# Altium schematic sheet Liquid Tremolo.SchDoc
size A3; SheetNumber: 1; SheetTotal: 1
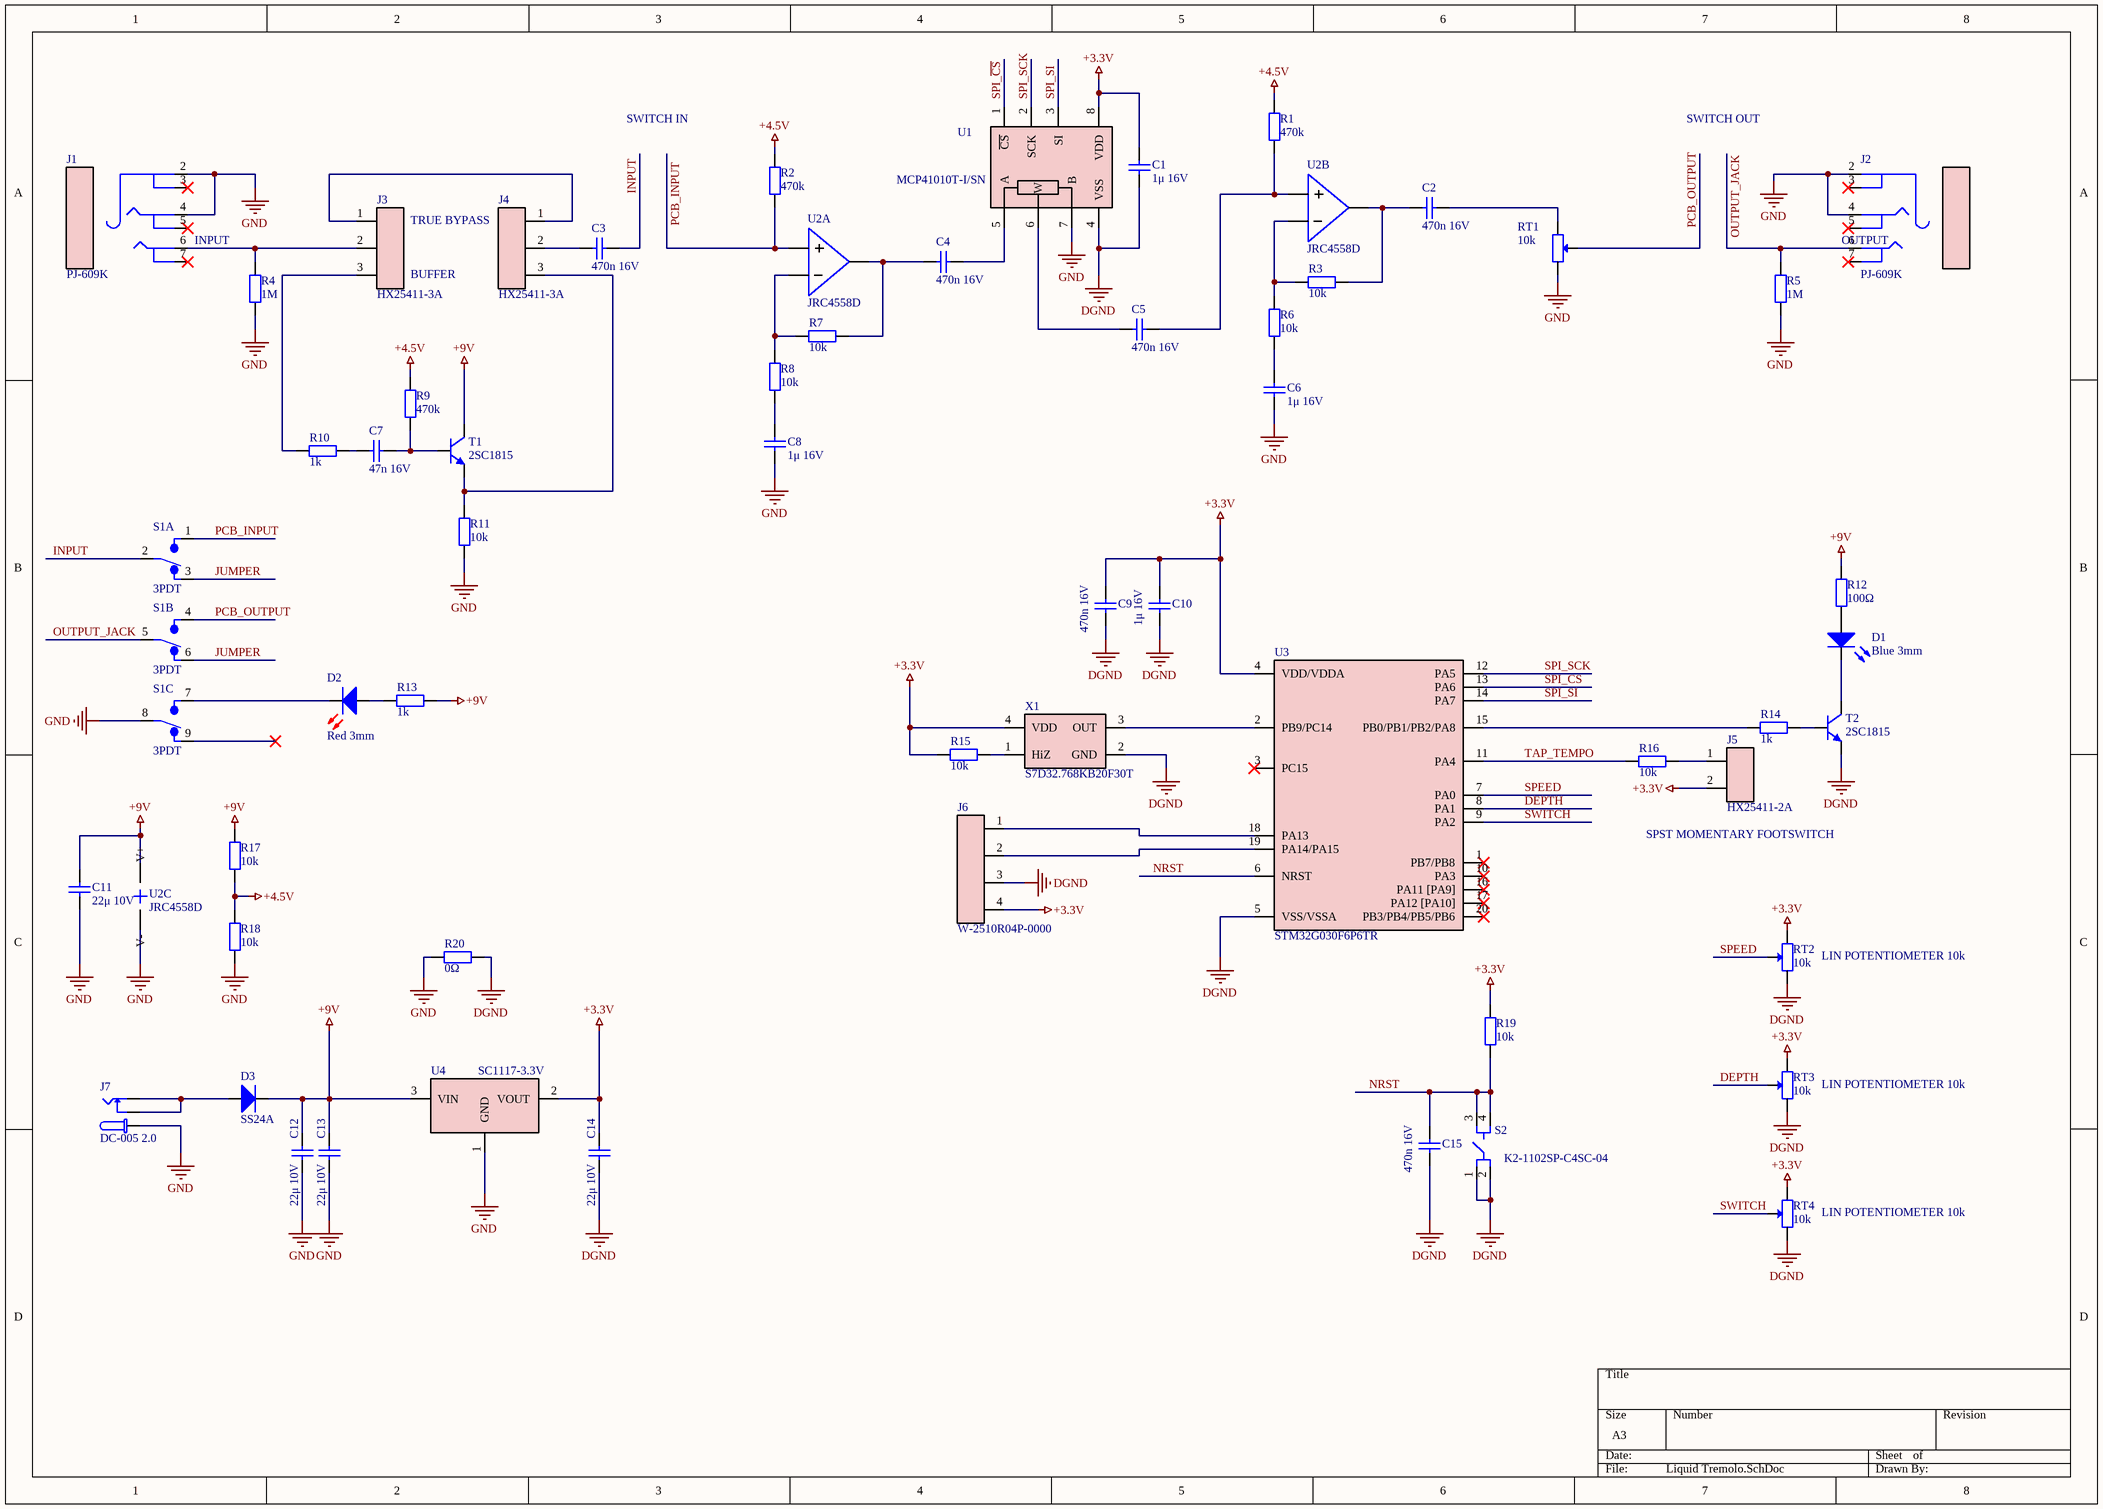
[diagram p0: Liquid Tremolo.SchDoc]

## Parts
C1  1μ 16V  [Capacitor 0603]
C2  470n 16V  [Capacitor 0603]
C3  470n 16V  [Capacitor 0603]
C4  470n 16V  [Capacitor 0603]
C5  470n 16V  [Capacitor 0603]
C6  1μ 16V  [Capacitor 0603]
C7  47n 16V  [Capacitor 0603]
C8  1μ 16V  [Capacitor 0603]
C9  470n 16V  [Capacitor 0603]
C10  1μ 16V  [Capacitor 0603]
C11  22μ 10V  [Capacitor 0603]
C12  22μ 10V  [Capacitor 0603]
C13  22μ 10V  [Capacitor 0603]
C14  22μ 10V  [Capacitor 0603]
C15  470n 16V  [Capacitor 0603]
D1  Blue 3mm  [LED 3MM BLUE]
D2  Red 3mm  [LED 3MM BLUE]
D3  SS24A  [SS24A]
J1  PJ-609K  [HOOYA PJ-609K]
J2  PJ-609K  [HOOYA PJ-609K]
J3  HX25411-3A  [HX25411-3A]
J4  HX25411-3A  [HX25411-3A]
J5  HX25411-2A  [HX25411-2A]
J6  W-2510R04P-0000  [W-2510R04P-0000]
J7  DC-005 2.0  [DC-005 2.0]
R1  470k  [Resistor 0603]
R2  470k  [Resistor 0603]
R3  10k  [Resistor 0603]
R4  1M  [Resistor 0603]
R5  1M  [Resistor 0603]
R6  10k  [Resistor 0603]
R7  10k  [Resistor 0603]
R8  10k  [Resistor 0603]
R9  470k  [Resistor 0603]
R10  1k  [Resistor 0603]
R11  10k  [Resistor 0603]
R12  100Ω  [Resistor 0603]
R13  1k  [Resistor 0603]
R14  1k  [Resistor 0603]
R15  10k  [Resistor 0603]
R16  10k  [Resistor 0603]
R17  10k  [Resistor 0603]
R18  10k  [Resistor 0603]
R19  10k  [Resistor 0603]
R20  0Ω  [Resistor 0603]
RT1  10k  [RK09D1130C2P]
RT2  10k  [RK09D1130C2P]
RT3  10k  [RK09D1130C2P]
RT4  10k  [RK09D1130C2P]
S1  3PDT  [3PDT]  (parts A,B,C of 3)
S2  K2-1102SP-C4SC-04  [K2-1102SP-C4SC-04]
T1  2SC1815  [2SC1815]
T2  2SC1815  [2SC1815]
U1  MCP41010T-I/SN  [MCP41010]
U2  JRC4558D  [JRC4558]  (parts A,B,C of 3)
U3  STM32G030F6P6TR  [STM32G030F6P6TR]
U4  SC1117-3.3V  [SC1117-3.3V]
X1  S7D32.768KB20F30T  [S7D32.768KB20F30T]

## Nets
+3.3V: C1.1 C9.2 C10.2 C14.2 J5.2 J6.4 R15.1 R19.2 RT2.1 RT3.1 RT4.1 U1.8(VDD) U3.4(VDD/VDDA) U4.2(VOUT) X1.4(VDD)
+4.5V: R1.2 R2.2 R9.2 R17.1 R18.2
+9V: C11.2 C12.2 C13.2 D3.2 R12.2 R13.2 R17.2 T1.3(C) U2.8(V+) U4.3(VIN)
DGND: C1.2 C9.1 C10.1 C14.1 C15.1 J6.3 R20.2 RT2.3 RT3.3 RT4.3 S2.1 S2.2 T2.2(E) U1.4(VSS) U3.5(VSS/VSSA) X1.2(GND)
GND: C6.1 C8.1 C11.1 C12.1 C13.1 J1.2 J1.4 J2.2 J2.4 J7.4 R4.1 R5.1 R11.1 R18.1 R20.1 RT1.3 S1.8 U1.7(B) U2.4(V-) U4.1(GND)
DEPTH: RT3.2 U3.8(PA1)
INPUT: C3.2 S1.2
JUMPER: S1.3 S1.6
NRST: C15.2 R19.1 S2.3 S2.4 U3.6(NRST)
OUTPUT_JACK: J2.6 R5.2 S1.5
PCB_INPUT: R2.1 S1.1 U2.3(IN+)
PCB_OUTPUT: RT1.2 S1.4
SPEED: RT2.2 U3.7(PA0)
SPI_~{CS}: U1.1(~{CS}) U3.13(PA6)
SPI_SCK: U1.2(SCK) U3.12(PA5)
SPI_SI: U1.3(SI) U3.14(PA7)
SWITCH: RT4.2 U3.9(PA2)
TAP_TEMPO: R16.1 U3.11(PA4)
NetC2_1: C2.1 R3.1 U2.7(OUT)
NetC2_2: C2.2 RT1.1
NetC3_1: C3.1 J4.2
NetC4_1: C4.1 R7.1 U2.1(OUT)
NetC4_2: C4.2 U1.5(A)
NetC5_1: C5.1 U1.6(W)
NetC5_2: C5.2 R1.1 U2.5(IN+)
NetC6_2: C6.2 R6.1
NetC7_1: C7.1 R10.2
NetC7_2: C7.2 R9.1 T1.1(B)
NetC8_2: C8.2 R8.1
NetD1_1: D1.1 T2.3(C)
NetD1_2: D1.2 R12.1
NetD2_1: D2.1 S1.7
NetD2_2: D2.2 R13.1
NetD3_1: D3.1 J7.2 J7.3
NetJ1_6: J1.6 J3.2 R4.2
NetJ3_1: J3.1 J4.1
NetJ3_3: J3.3 R10.1
NetJ4_3: J4.3 R11.2 T1.2(E)
NetJ5_1: J5.1 R16.2
NetJ6_1: J6.1 U3.18(PA13)
NetJ6_2: J6.2 U3.19(PA14/PA15)
NetR3_2: R3.2 R6.2 U2.6(IN-)
NetR7_2: R7.2 R8.2 U2.2(IN-)
NetR14_1: R14.1 U3.15(PB0/PB1/PB2/PA8)
NetR14_2: R14.2 T2.1(B)
NetR15_2: R15.2 X1.1(HiZ)
NetU3_2: U3.2(PB9/PC14) X1.3(OUT)

Not connected (* = marked no-connect by the designer): J1 3* 5* 7*; J2 3* 5* 7*; S1 9*; U3 1(PB7/PB8)* 3(PC15)* 10(PA3)* 16(PA11_[PA9])* 17(PA12_[PA10])* 20(PB3/PB4/PB5/PB6)*

## Notes on the sheet
- SWITCH IN
- SWITCH OUT
- INPUT
- TRUE BYPASS
- OUTPUT
- (near J3) BUFFER
- (near J5) SPST MOMENTARY FOOTSWITCH
- (near RT2) LIN POTENTIOMETER 10k
- (near RT3) LIN POTENTIOMETER 10k
- (near RT4) LIN POTENTIOMETER 10k

## Library data of the parts
C1 C6 C8 C10 = Capacitor 1μF 0603 ±10% 16V: X7R ±10% 1uF 16V 0603 Multilayer Ceramic Capacitors MLCC - SMD/SMT ROHS; Mfr. Part #: CC0603KRX7R7BB105; Type: SMD; LCSC Part #: C106248; Package: 0603; ComponentLink1Description: Datasheet; ComponentLink1URL: https://datasheet.lcsc.com/lcsc/1811082135_YAGEO-CC0603KRX7R7BB473_C115058.pdf
C2-C5 C9 C15 = Capacitor 470nF 0603 ±10% 16V: X7R ±10% 470nF 16V 0603 Multilayer Ceramic Capacitors MLCC - SMD/SMT ROHS; Mfr. Part #: CC0603KRX7R7BB474; Type: SMD; LCSC Part #: C106851; Package: 0603; ComponentLink1Description: Datasheet; ComponentLink1URL: https://datasheet.lcsc.com/lcsc/1811082135_YAGEO-CC0603KRX7R7BB473_C115058.pdf
C7 = Capacitor 47nF 0603 ±10% 16V: X7R ±10% 47nF 16V 0603 Multilayer Ceramic Capacitors MLCC - SMD/SMT ROHS; Mfr. Part #: CC0603KRX7R7BB473; Type: SMD; LCSC Part #: C115058; Package: 0603; ComponentLink1Description: Datasheet; ComponentLink1URL: https://datasheet.lcsc.com/lcsc/1811082135_YAGEO-CC0603KRX7R7BB473_C115058.pdf
C11-C14 = Capacitor 22μF 0603 ±10% 16V: X5R ±20% 10V 22uF 0603 Multilayer Ceramic Capacitors MLCC - SMD/SMT ROHS; Mfr. Part #: 0603X226M100NT; Type: SMD; LCSC Part #: C60077; Package: 0603; ComponentLink1Description: Datasheet; ComponentLink1URL: https://datasheet.lcsc.com/lcsc/1811151152_FH-Guangdong-Fenghua-Advanced-Tech-0603X226M100NT_C60077.pdf
D1 = Diode LED Blue 3mm THT: Blue 460nm~470nm 2.7V~3.6V Through Hole Light Emitting Diodes (LED) ROHS; Mfr. Part #: TJ-L3FYTGCBMCGSFLC6B-A5; Type: THT; LCSC Part #: C330760; Package: Through Hole; ComponentLink1Description: Datasheet; ComponentLink1URL: https://datasheet.lcsc.com/lcsc/2006301911_TOGIALED-TJ-L3FYTGCBMCGSFLC6B-A5_C330760.pdf
D2 = Diode LED Red 3mm THT: Red 620nm~630nm 1.8V~2.6V Through Hole Light Emitting Diodes (LED) ROHS; Mfr. Part #: TJ-L4FYTGCRMFCSFLC2R-A5; Type: THT; LCSC Part #: C331039; Package: Through Hole; ComponentLink1Description: Datasheet; ComponentLink1URL: https://datasheet.lcsc.com/lcsc/2006301911_TOGIALED-TJ-L3FYTGCBMCGSFLC6B-A5_C330760.pdf
D3 = Diode 40V 2A 500mV SS24A: 40V 2A 500mV @ 2A SMA(DO-214AC) Schottky Barrier Diodes (SBD) ROHS; Type: SMD; Mfr. Part #: SS24A; LCSC Part #: C181203; Package: SMA(DO-214AC); ComponentLink1Description: Datasheet; ComponentLink1URL: https://datasheet.lcsc.com/lcsc/1811151533_Guangdong-Hottech-SS24A_C181203.pdf
J1 J2 = Mechanical Connector JACK 6.35mm PJ-609K: 6.35mm Plug-in headphone holder Horizontal 6 Female - Audio & Video Connectors ROHS; Mfr. Part #: PJ-609K; LCSC Part #: C309276; Package: -; ComponentLink1Description: Datasheet; ComponentLink1URL: https://datasheet.lcsc.com/lcsc/1912111437_HOOYA-PJ-609K_C309276.pdf; Type: THT
J3 J4 = Mechanical Connector 3P 2.54mm THT HX25411-3A: 3 Header CH 0.100"(2.54mm) Male Pin Through Hole Wire To Board / Wire To Wire Connector ROHS; Mfr. Part #: HX25411-3A; LCSC Part #: C190647; Package: Through Hole; ComponentLink1Description: Datasheet; ComponentLink1URL: https://datasheet.lcsc.com/lcsc/1811151531_HX-Zhejiang-Yueqing-Hongxing-Elec-HX25411-3A_C190647.pdf; Type: THT
J5 = Mechanical Connector 2P 2.54mm THT HX25411-2A: LCSC Part # C181912 / Package P=2.54mm / Manufacturer HX(Zhejiang Yueqing Hongxing Elec); Mfr. Part #: HX25411-2A; LCSC Part #: C181912; Package: P=2.54mm; ComponentLink1Description: Datasheet; ComponentLink1URL: https://datasheet.lcsc.com/lcsc/1810161736_HX-Zhejiang-Yueqing-Hongxing-Elec-HX25411-2A_C181912.pdf; Type: THT
J6 = Mechanical Connector 4P 2.54mm THT Right Angle W-2510R04P-0000: 4 Header MX2.54 0.100"(2.54mm) Male Pin Through Hole,P=2.54mm Wire To Board / Wire To Wire Connector ROHS; Mfr. Part #: W-2510R04P-0000; LCSC Part #: C169027; Package: Through Hole; ComponentLink1Description: Datasheet; ComponentLink1URL: https://datasheet.lcsc.com/lcsc/1810222331_Ckmtw-Shenzhen-Cankemeng-W-2510R04P-0000_C169027.pdf; Type: THT
J7 = Mechanical DC Jack DC-005 2.0: Through Hole AC/DC Power Plugs & Receptacles ROHS; Mfr. Part #: DC-005 2.0; LCSC Part #: C16214; Package: Through Hole; ComponentLink1Description: Datasheet; ComponentLink1URL: https://datasheet.lcsc.com/lcsc/1811051112_BOOMELE-Boom-Precision-Elec-DC-005-2-0_C16214.pdf; Type: THT
R1 R2 R9 = Resistor 470kΩ 0603 ±1% 0.1W: ±1% 470kΩ ±100ppm/℃ 0.1W 0603 Chip Resistor - Surface Mount ROHS; Mfr. Part #: 0603WAF4703T5E; LCSC Part #: C23178; Package: 0603; ComponentLink1Description: Datasheet; ComponentLink1URL: https://datasheet.lcsc.com/lcsc/1811021221_UNI-ROYAL-Uniroyal-Elec-0603WAF4703T5E_C23178.pdf; Type: SMD
R3 R6-R8 R11 R15-R19 = Resistor 10kΩ 0603 ±1% 0.1W: ±1% ±100ppm/℃ 10kΩ 0.1W 0603 Chip Resistor - Surface Mount ROHS; Mfr. Part #: 0603WAF1002T5E; LCSC Part #: C25804; Package: 0603; ComponentLink1Description: Datasheet; ComponentLink1URL: https://datasheet.lcsc.com/lcsc/1811021221_UNI-ROYAL-Uniroyal-Elec-0603WAF4703T5E_C23178.pdf; Type: SMD
R4 R5 = Resistor 1MΩ 0603 ±1% 0.1W: 1MΩ ±1% 0.1W 0603 Chip Resistor - Surface Mount ROHS; Mfr. Part #: RMC06031M1%N; LCSC Part #: C269705; Package: 0603; ComponentLink1Description: Datasheet; ComponentLink1URL: https://datasheet.lcsc.com/lcsc/1811101311_TyoHM-RMC06031M1-N_C269705.pdf; Type: SMD
R10 R13 R14 = Resistor 1kΩ 0603 ±1% 0.1W: ±1% ±100ppm/℃ 1kΩ 0.1W 0603 Chip Resistor - Surface Mount ROHS; Mfr. Part #: RC0603FR-071KL; LCSC Part #: C22548; Package: 0603; ComponentLink1Description: Datasheet; ComponentLink1URL: https://datasheet.lcsc.com/lcsc/1810182020_YAGEO-RC0603FR-071KL_C22548.pdf; Type: SMD
R12 = Resistor 100Ω 0603 ±1% 0.1W: ±1% ±200ppm/℃ 100Ω 0.1W 0603 Chip Resistor - Surface Mount ROHS; Mfr. Part #: 0603WAF1000T5E; LCSC Part #: C22775; Package: 0603; ComponentLink1Description: Datasheet; ComponentLink1URL: https://datasheet.lcsc.com/lcsc/1811021221_UNI-ROYAL-Uniroyal-Elec-0603WAF4703T5E_C23178.pdf; Type: SMD
R20 = Resistor 0Ω 0603 ±1% 0.1W: 75V -55℃~+155℃ ±1% Thick Film Resistors 100mW 0Ω 0603 Chip Resistor - Surface Mount ROHS; Mfr. Part #: RC0603FR-070RL; LCSC Part #: C100044; Package: 0603; ComponentLink1Description: Datasheet; ComponentLink1URL: https://datasheet.lcsc.com/lcsc/1810182020_YAGEO-RC0603FR-071KL_C22548.pdf; Type: SMD
RT1-RT4 = Potentiometer 10kΩ plugin ±20% RK09D1130C2P: ±20% 10kΩ Plugin Variable Resistors/Potentiometers ROHS; Mfr. Part #: RK09D1130C2P; LCSC Part #: C361173; Package: Plugin; ComponentLink1Description: Datasheet; ComponentLink1URL: https://datasheet.lcsc.com/lcsc/1912111437_ALPSALPINE-RK09D1130C2P_C361173.pdf; Type: THT
S1 = Mechanical 3PDT Footswitch: Top Actuated 50mA @ 12VDC Round Button SPST 6*6mm Tactile Switches ROHS; ComponentLink1Description: Datasheet; ComponentLink1URL: https://effectpedalkits.com/wp-content/uploads/2018/02/3pdt-latching-footswitch-dimensions.jpg
S2 = Mechanical Tactile Switch 6x6mm SMD: Top Actuated 50mA @ 12VDC Round Button SPST 6*6mm Tactile Switches ROHS; Mfr. Part #: K2-1102SP-C4SC-04; LCSC Part #: C127509; Package: 6*6mm; ComponentLink1Description: Datasheet; ComponentLink1URL: https://datasheet.lcsc.com/lcsc/1811082113_Korean-Hroparts-Elec-K2-1102SP-C4SC-04_C127509.pdf; Type: SMD
T1 T2 = Transistor 2SC1815 50V 0.2W 0.15A NPN SOT-23: 50V 0.2W 0.15A NPN SOT-23(SOT-23-3) Bipolar Transistors - BJT ROHS; Type: SMD; Mfr. Part #: 2SC1815; LCSC Part #: C181171; Package: SOT-23; ComponentLink1Description: Datasheet; ComponentLink1URL: https://datasheet.lcsc.com/lcsc/1810091731_Guangdong-Hottech-2SC1815_C181171.pdf
U1 = IC Digital Potentiometer SOIC-8 MCP41010T-I/SN: SOIC-8 Digital Potentiometers ROHS; Mfr. Part #: MCP41010T-I/SN; LCSC Part #: C136395; Package: SOIC-8; ComponentLink1Description: Datasheet; ComponentLink1URL: https://datasheet.lcsc.com/lcsc/1806121747_Microchip-Tech-MCP41010T-I-SN_C136395.pdf; Type: SMD
U2 = IC OP-AMP JRC4558D SOP-8: SOP-8 Operational Amplifier ROHS; Mfr. Part #: JRC4558D; LCSC Part #: C443686; Package: SOP-8; ComponentLink1Description: Datasheet; ComponentLink1URL: https://datasheet.lcsc.com/lcsc/1912111437_UMW-Youtai-Semiconductor-Co---Ltd--JRC4558D_C443686.pdf; Type: SMD
U3 = IC MCU STM32G030F6P6TR TSSOP-20: TSSOP-20 ST Microelectronics ROHS; Mfr. Part #: STM32G030F6P6TR; LCSC Part #: C529330; Package: SOIC-8; ComponentLink1Description: Datasheet; ComponentLink1URL: https://datasheet.lcsc.com/lcsc/2005192134_STMicroelectronics-STM32G030F6P6TR_C529330.pdf; Type: TSSOP-20
U4 = IC LDO 3.3V Fixed 700mA SOT-223 SC1117-3.3V: 12V 1.5V @ 700mA Fixed 3.3V SOT-223 Linear Voltage Regulators (LDO) ROHS; Mfr. Part #: SC1117-3.3V; LCSC Part #: C173386; Package: SOT-223; ComponentLink1Description: Datasheet; ComponentLink1URL: https://datasheet.lcsc.com/lcsc/2105181504_Shenzhen-Fuman-Elec-SC1117-3-3V_C173386.pdf; Type: SMD
X1 = Crystal Oscillator 32.768kHz S7D32.768KB20F30T: 3.3V 32.768KHz ±20ppm SMD7050-4P Oscillators ROHS; Mfr. Part #: S7D32.768KB20F30T; LCSC Part #: C387070; Package: SMD7050-4P; ComponentLink1Description: Datasheet; ComponentLink1URL: https://datasheet.lcsc.com/lcsc/1912111437_Shenzhen-SCTF-Elec-S7D32-768KB20F30T_C387070.pdf; Type: SMD